# EAGLE design gray_steer_detor (EAGLE 9.6.2)
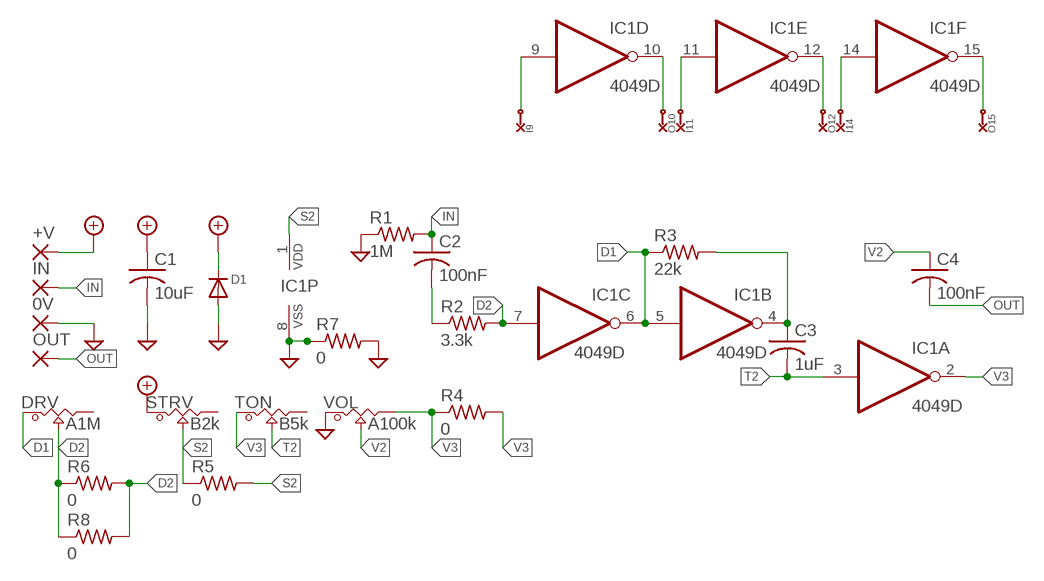
[diagram p0: schematic, sheet 1]

## Parts
0V  SMD2  [SMD1,27-2,54]
+V  SMD2  [SMD1,27-2,54]
C1  10uF  C-USC1206  [C1206]
C2  100nF  C-USC0603  [C0603]
C3  1uF  C-USC0603  [C0603]
C4  100nF  C-USC0603  [C0603]
D1  DIODESOD-123  [SOD-123]
DRV  A1M  POT_9MM_SMD  [POT_9MM_SMD]
I9  COM_SMD  [1PAD]
I11  COM_SMD  [1PAD]
I14  COM_SMD  [1PAD]
IC1  4049D  [SO16]
IN  SMD2  [SMD1,27-2,54]
O10  COM_SMD  [1PAD]
O12  COM_SMD  [1PAD]
O15  COM_SMD  [1PAD]
OUT  SMD2  [SMD1,27-2,54]
R1  1M  R-US_R0603  [R0603]
R2  3.3k  R-US_R0603  [R0603]
R3  22k  R-US_R0603  [R0603]
R4  0  R-US_R0402  [R0402]
R5  0  R-US_R0402  [R0402]
R6  0  R-US_R0402  [R0402]
R7  0  R-US_R0402  [R0402]
R8  0  R-US_R0402  [R0402]
STRV  B2k  POT_9MM_SMD  [POT_9MM_SMD]
TON  B5k  POT_9MM_SMD  [POT_9MM_SMD]
VOL  A100k  POT_9MM_SMD  [POT_9MM_SMD]

## Nets
+9V: +V.1(P) C1.1 D1.C STRV.1
D1: DRV.1 IC1.5(B:I) IC1.6(C:O) R3.1
D2: DRV.2 IC1.7(C:I) R2.2 R6.1 R6.2 R8.1 R8.2
GND: 0V.1(P) C1.2 D1.A IC1.8(P:VSS) R1.1 R7.1 R7.2 VOL.1
I9: I9.1 IC1.9(D:I)
I11: I11.1 IC1.11(E:I)
I14: I14.1 IC1.14(F:I)
IN: C2.1 IN.1(P) R1.2
N$2: C2.2 R2.1
O4: C3.1 IC1.4(B:O) R3.2
O10: IC1.10(D:O) O10.1
O12: IC1.12(E:O) O12.1
O15: IC1.15(F:O) O15.1
OUT: C4.2 OUT.1(P)
S2: IC1.1(P:VDD) R5.1 R5.2 STRV.2
T2: C3.2 IC1.3(A:I) TON.2
V2: C4.1 VOL.2
V3: IC1.2(A:O) R4.1 R4.2 TON.1 VOL.3
Unconnected: DRV.3 STRV.3 TON.3

## Library data of the parts
0V +V IN OUT = wirepad:SMD2: SMD PAD
C1-C4 = adafruit:C-US: CAPACITOR, American symbol
D1 = adafruit:DIODE: Diode SMADIODE - SMA Surface Mount Package 20V 1A Schottky Diode Digikey: 641-1014-6-ND DO-1N4148 - Through Hole Small Current Diode SOD-123 20V 1 A (.5mV Vf) Schottky Diode - Digikey: MBRX120TPMSCT-ND SOD-323 10V 570mA (.38mV Vf, 3ns) Schottky Diode - Digikey: ZLLS410CT-ND SOD-523 30V 30mA Schottky Diode (RB751S-40TE61) - Digikey: RB751S-40TE61CT-ND SOT23-R/W - SOT23 Package (R = Solder Paste/Reflow Ovens, W = Hand-Soldering) BAT54Film 40V 300mA - Digikey: 497-7162-1-ND
DRV STRV TON VOL = Mech_BO_CE_SW:POT_9MM_SMD
I9 I11 I14 O10 O12 O15 = Mech_BO_CE_SW:COM_SMD
IC1 = 40xx:4049: Hex inverting BUFFER
R1-R8 = adafruit:R-US_: RESISTOR, American symbol

## Board
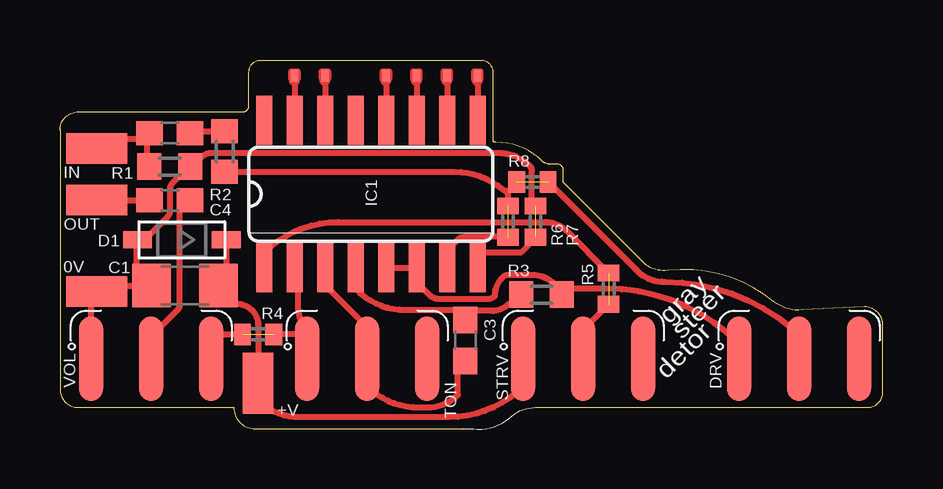
[diagram p1: board, top side]

Size 34.29 x 15.37 mm. Coordinates in mm from the lower left corner, seen from the top.
Outline: 16.76,0 8.13,0 arc-90 7.24,0.89 0.76,0.89 arc-90 0,1.65 0,12.45 arc-90 0.76,13.21 7.62,13.21 arc90 7.87,13.46 7.87,14.86 arc-90 8.38,15.37 17.53,15.37 arc-90 18.03,14.86 18.03,11.99 arc45 18.16,11.94 arc-45 20.1,11.14 arc45 20.33,11.05
Outline: 19.81,0.89 33.66,0.89 arc90 34.29,1.52 34.29,4.32 arc90 33.53,5.08 30.92,4.95 arc-45 29.75,5.3 arc45 25.34,6.6 25.34,6.6 arc-45 24.41,6.83 20.95,10.29 20.95,10.79 arc90 20.7,11.05 20.32,11.05
Copper layers (1*16): Top 0.035mm / dielectric 1.5mm / Bottom 0.035mm
Design rules "default *": minimum track width 6mil, minimum drill 0.35mm, track to track 6mil, track to pad 6mil, pad to pad 6mil, via to via 6mil, smd to smd 6mil, copper to edge 10mil, drill to drill 6mil, minimum pad ring 10mil, minimum via ring 8mil, stop-mask expansion 4mil, vias tented up to drill 0mil, thermal gap 10mil

### Footprints (pad centres in the part's own frame; a part is rotated, then mirrored left to right if it is on the bottom)
SMD1,27-2,54 = smd 1.27 x 2.54: 1 0,0
C1206 = smd 1.6 x 1.8: 1 -1.4,0; 2 1.4,0
C0603 = smd 1.1 x 1: 1 -0.85,0; 2 0.85,0
SOD-123 = smd 1.2 x 0.7: A 1.85,0; C -1.85,0
POT_9MM_SMD = smd 0.991 x 3.505: 1 -2.5,0; 2 0,0; 3 2.5,0
1PAD = smd 0.31 x 0.5: 1 0,0.267
SO16 = smd 0.66 x 2.032: 1 -4.445,-3.073; 2 -3.175,-3.073; 3 -1.905,-3.073; 4 -0.635,-3.073; 5 0.635,-3.073; 6 1.905,-3.073; 7 3.175,-3.073; 8 4.445,-3.073; 9 4.445,3.073; 10 3.175,3.073; 11 1.905,3.073; 12 0.635,3.073; 13 -0.635,3.073; 14 -1.905,3.073; 15 -3.175,3.073; 16 -4.445,3.073
R0603 = smd 1 x 1.1: 1 -0.85,0; 2 0.85,0
R0402 = smd 0.7 x 0.9: 1 -0.65,0; 2 0.65,0

### Placement (x,y rotation side)
0V  1.52,5.71 90 top
+V  8.26,1.91 180 top
C1  5.21,5.97 180 top
C2  4.57,12.32 0 top
C3  16.89,3.68 270 top
C4  4.57,9.53 180 top
D1  5.08,7.87 180 top
DRV  30.8,2.92 0 top
I9  17.4,14.99 180 top
I11  14.86,14.99 180 top
I14  11.05,14.99 180 top
IC1  12.95,9.78 0 top
IN  1.52,11.68 90 top
O10  16.13,14.99 180 top
O12  13.59,14.99 180 top
O15  9.78,14.99 180 top
OUT  1.52,9.53 90 top
R1  4.57,10.92 180 top
R2  6.86,11.56 270 top
R3  20.07,5.59 180 top
R4  8.26,3.94 0 top
R5  22.86,5.84 90 top
R6  18.67,8.64 90 top
R7  19.81,8.64 90 top
R8  19.68,10.29 0 top
STRV  21.8,2.92 0 top
TON  12.8,2.92 0 top
VOL  3.8,2.92 0 top

### Tracks (layer width: path | path; a pad name or v marks a point on that pad's centre or on a via)
+9V
  Top 0.254: D1.C 6.93,6.29 C1.1 7.37,5.21 arc-90 8.26,4.32 +V.1 8.26,1.19 arc45 9.96,0.48 16.2,0.48 arc45 19.3,1.76 STRV.1
D1
  Top 0.254: IC1.5 IC1.6 14.86,6.11 15.37,5.6 arc45 15.82,5.41 17.81,5.41 arc45 18.13,5.54 arc-45 18.45,6.32 arc-45 18.68,6.42 19.69,6.42 arc-45 20.59,6.04 20.92,5.71 R3.1 21.17,5.84 22.74,5.84 arc-45 28.3,3.54 DRV.1
D2  (2 unrouted)
  Top 0.254: IC1.7 16.15,6.73 16.15,7.46 16.59,7.89 arc-45 16.86,8 18.65,8 R6.1 | R6.2 18.67,9.78 | 18.67,9.78 18.67,9.92 R8.1 | R8.2 24,6.62 arc45 25.21,6.12 | 25.21,6.12 | 25.21,6.12 arc-45 30.99,3.73 30.99,3.11 DRV.2 | R2.2 16.43,10.71 arc-45 18.67,9.78
GND  (1 unrouted)
  Top 0.254: 1.45,2.92 VOL.1 1.3,5.49 0V.1 1.78,5.97 C1.2 3.17,6.6 3.17,7.82 D1.A 3.34,7.98 3.63,7.98 4.48,8.84 arc45 4.59,9.11 4.59,10.03 arc-45 4.67,10.22 5.37,10.92 R1.1 5.5,10.92 5.92,11.34 arc-45 6.28,11.49 18.26,11.49 arc-45 19.59,10.94 arc-45 19.66,10.75 19.66,9.43 R7.2 19.81,9.34 | IC1.8 17.4,7.34 17.41,7.36 19.23,7.36 19.81,7.93 R7.1
I9
  Top 0.254: I9.1 IC1.9
I11
  Top 0.254: I11.1 IC1.11
I14
  Top 0.254: I14.1 IC1.14
IN
  Top 0.254: IN.1 1.91,12.06 3.47,12.06 3.64,12.24 | 3.64,12.24 C2.1 | R1.2 3.64,11.01 3.64,12.24
N$2
  Top 0.254: C2.2 5.51,12.41 R2.1
O4
  Top 0.254: R3.2 18.84,5.21 18.71,5.21 arc-45 18,4.91 17.27,4.91 C3.1 16.47,4.95 14.4,4.95 arc-45 12.32,5.82 IC1.4
O10
  Top 0.254: O10.1 IC1.10
O12
  Top 0.254: O12.1 IC1.12
O15
  Top 0.254: O15.1 IC1.15
OUT
  Top 0.254: OUT.1 C4.2
S2  (1 unrouted)
  Top 0.254: STRV.2 21.8,4.13 R5.1 | IC1.1 8.51,7.34 arc-45 11.59,8.62 20.21,8.62 arc-45 21.11,8.24 R5.2
T2
  Top 0.254: IC1.3 11.2,6.55 11.2,5.83 12.83,4.2 12.83,2.95 TON.2 12.8,1.78 arc45 14.95,0.89 15.31,0.89 arc45 16.58,1.42 16.58,2.4 16.89,2.71 C3.2
V2
  Top 0.254: C4.1 5,9.1 5,5.18 arc-45 4.92,4.98 3.8,3.87 VOL.2
V3  (1 unrouted)
  Top 0.254: 9.65,7.24 9.65,6.83 IC1.2 9.92,6.57 9.92,5.11 arc45 10.3,4.19 TON.1 | TON.1 10.3,3.94 10.16,3.94 | VOL.3 6.3,3.94 R4.1 | TON.1 10.3,3.68 10.05,3.94 R4.2

### Text on the board
tPlace: gray | steer | detor